# Altium schematic sheet CP2102.SchDoc
size A4
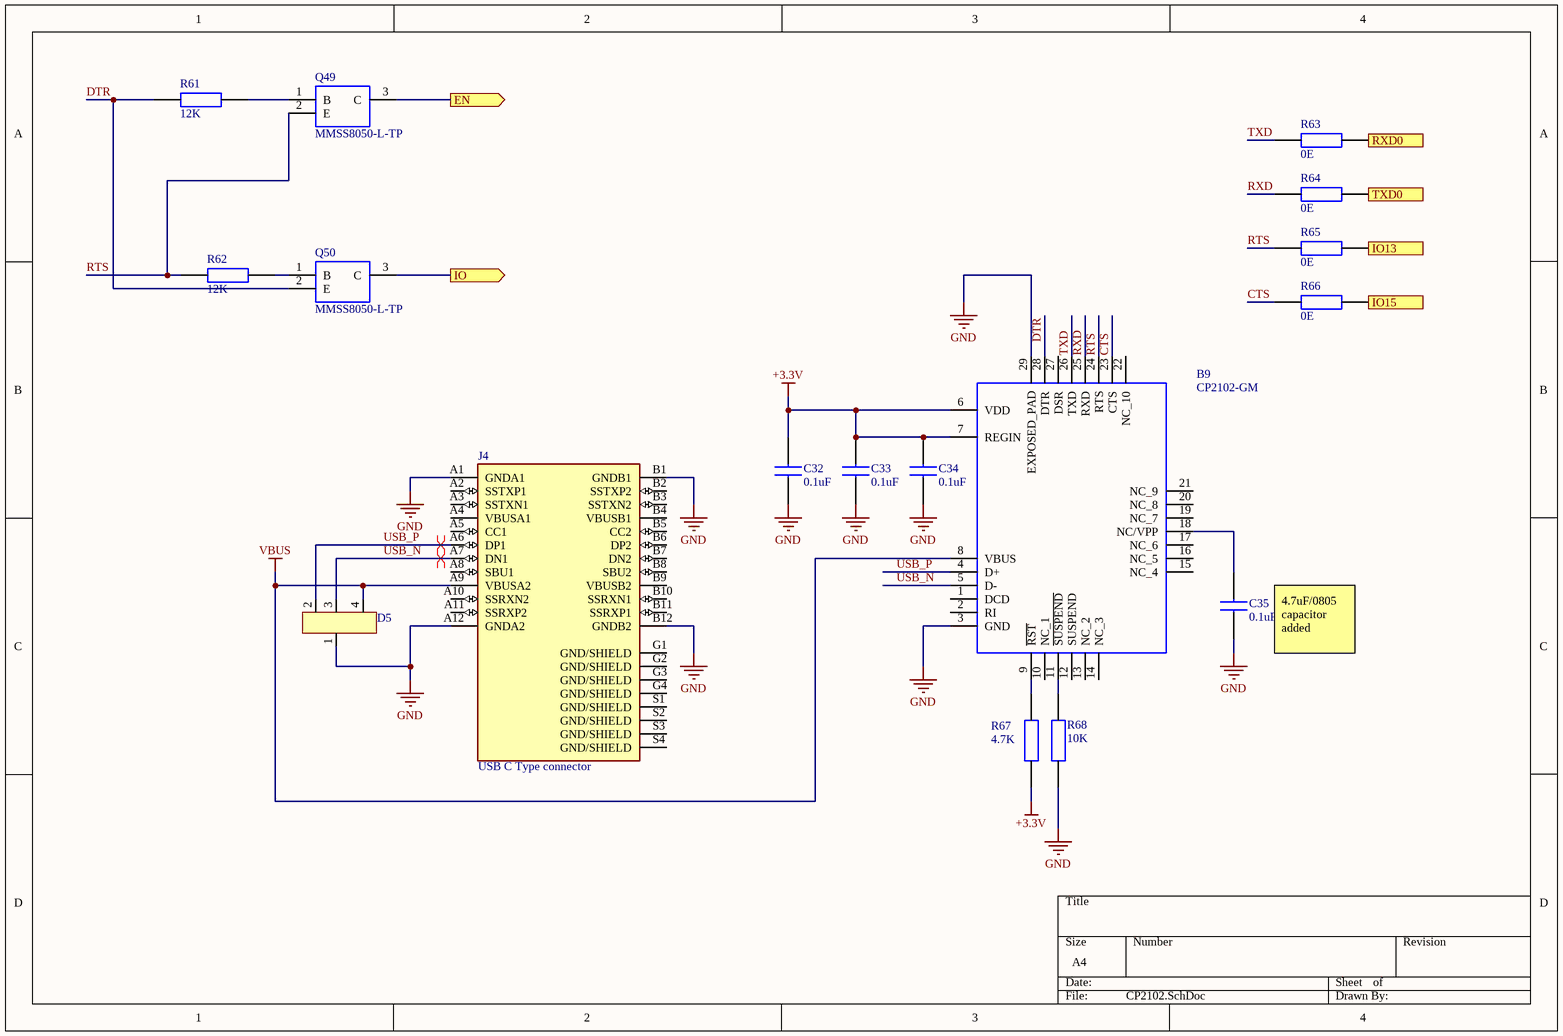
[diagram p0: CP2102.SchDoc]

## Parts
B9  CP2102-GM  [QFN-28]
C32  0.1uF  [CAPC1005X55N]
C33  0.1uF  [CAPC1005X55N]
C34  0.1uF  [CAPC1005X55N]
C35  0.1uF  [CAPC1005X55N]
D5  SP0504BAJTG_ESD Diode  [SOT-143-4]  (value not drawn)
J4  USB C Type connector  [USB C Type connector]
Q49  MMSS8050-L-TP  [SOT96P237X112-3N]
Q50  MMSS8050-L-TP  [SOT96P237X112-3N]
R61  12K  [RESC1005X40N]
R62  12K  [RESC1005X40N]
R63  0E  [RESC1005X40N]
R64  0E  [RESC1005X40N]
R65  0E  [RESC1005X40N]
R66  0E  [RESC1005X40N]
R67  4.7K  [RESC1005X40N]
R68  10K  [RESC1005X40N]

## Ports
EN (out), IO13 (out), IO15 (out), IO (out), RXD0 (out), TXD0 (in)

## Nets
+3.3V: B9.6(VDD) B9.7(REGIN) C32.2 C33.2 C34.2 R67.1
GND: B9.3(GND) B9.29(EXPOSED_PAD) C32.1 C33.1 C34.1 C35.1 D5.1 J4.A1(GNDA1) J4.A12(GNDA2) J4.B1(GNDB1) J4.B12(GNDB2) R68.1
VBUS: B9.8(VBUS) D5.4 J4.A9(VBUSA2)
CTS: B9.23(CTS) R66.1
DTR: B9.28(DTR) Q50.2(E) R61.1
EN: Q49.3(C) ; port EN
IO: Q50.3(C) ; port IO
IO13: R65.2 ; port IO13
IO15: R66.2 ; port IO15
RTS: B9.24(RTS) Q49.2(E) R62.1 R65.1
RXD: B9.25(RXD) R64.1
RXD0: R63.2 ; port RXD0
TXD: B9.26(TXD) R63.1
TXD0: R64.2 ; port TXD0
USB_N: B9.5(D-) D5.3 J4.A7(DN1)
USB_P: B9.4(D+) D5.2 J4.A6(DP1)
NetB9_9: B9.9(~{RST}) R67.2
NetB9_11: B9.11(~{SUSPEND}) R68.2
NetB9_18: B9.18(NC/VPP) C35.2
NetQ49_1: Q49.1(B) R61.2
NetQ50_1: Q50.1(B) R62.2

Not connected (* = marked no-connect by the designer): B9 1(DCD) 2(RI) 10(NC_1) 12(SUSPEND) 13(NC_2) 14(NC_3) 15(NC_4) 16(NC_5) 17(NC_6) 19(NC_7) 20(NC_8) 21(NC_9) 22(NC_10) 27(DSR); J4 A2(SSTXP1) A3(SSTXN1) A4(VBUSA1) A5(CC1) A8(SBU1) A10(SSRXN2) A11(SSRXP2) B2(SSTXP2) B3(SSTXN2) B4(VBUSB1) B5(CC2) B6(DP2) B7(DN2) B8(SBU2) B9(VBUSB2) B10(SSRXN1) B11(SSRXP1) G1(GND/SHIELD) G2(GND/SHIELD) G3(GND/SHIELD) G4(GND/SHIELD) S1(GND/SHIELD) S2(GND/SHIELD) S3(GND/SHIELD) S4(GND/SHIELD)

## Layout directives
differential pair: USB_N, USB_P

## Notes on the sheet
- (near C35) 4.7uF/0805 capacitor added

## Library data of the parts
B9 = CP2102-GM: CP2102-GM, USB Controller 12Mbit/s USB 2.0, 3.3 V, 28-Pin, QFN; Manufacturer_Name: Silicon Labs; Geometry.Height: 1mm; Manufacturer_Part_Number: CP2102-GM; Arrow Part Number: CP2102-GM; Arrow Price/Stock: https://www.arrow.com/en/products/cp2102-gm/silicon-labs; Mouser Part Number: 634-CP2102-GM; Mouser Price/Stock: https://www.mouser.co.uk/ProductDetail/Silicon-Labs/CP2102-GM?qs=yHCtFi5ROqJvCcyR88R4Pg%3D%3D; Datasheet Link: http://docs-emea.rs-online.com/webdocs/065a/0900766b8065a805.pdf
C32-C35 = C0402C104M4RECTU: Multilayer Ceramic Capacitors MLCC - SMD/SMT 16V 0.1uF X7R 0402 20%; Manufacturer: Kemet; Part Number: C0402C104M4RECTU; Mouser Link: *; F: *
D5 = SP0504BAJTG_ESD Diode: Part Number: SP0503BAHTG; Manufacturer: Little Fuse; Footprint Doc: SOT-143-4
J4 = USB C Type connector: Part Number: 632723100011
Q49 Q50 = MMSS8050-L-TP: Bipolar Transistors - BJT 625mW, 25V, 1500mA; Manufacturer_Name: Micro Commercial Components (MCC); Geometry.Height: 1.12mm; Manufacturer_Part_Number: MMSS8050-L-TP; Arrow Part Number: MMSS8050-L-TP; Arrow Price/Stock: https://www.arrow.com/en/products/mmss8050-l-tp/micro-commercial-components; Mouser Part Number: 833-MMSS8050-L-TP; Mouser Price/Stock: https://www.mouser.co.uk/ProductDetail/Micro-Commercial-Components-MCC/MMSS8050-L-TP?qs=FaVZESsvgnebflbaqJWJVQ%3D%3D; Datasheet Link: https://componentsearchengine.com/Datasheets/1/MMSS8050-L-TP.pdf
R61 R62 = RC0402FR-0712KL: RESISTOR, 0402 12K Ohms +/-1% 1/16 W; Manufacturer_Name: YAGEO (PHYCOMP); Geometry.Height: 0.4mm; Manufacturer_Part_Number: RC0402FR-0712KL; Arrow Part Number: RC0402FR-0712KL; Arrow Price/Stock: *; Mouser Part Number: 603-RC0402FR-0712KL; Mouser Price/Stock: https://www.mouser.com/Search/Refine.aspx?Keyword=603-RC0402FR-0712KL; Datasheet Link: http://www.yageo.com/documents/recent/PYu-RC0402_51_RoHS_L_6_r.pdf
R63-R66 = RC0402FR-070RL: Thick Film Resistors - SMD 0.0ohm 1%; Manufacturer_Name: YAGEO (PHYCOMP); Geometry.Height: 0.4mm; Manufacturer_Part_Number: RC0402FR-070RL; Arrow Part Number: RC0402FR-070RL; Arrow Price/Stock: https://www.arrow.com/en/products/rc0402fr-070rl/yageo; Mouser Part Number: 603-RC0402FR-070RL; Mouser Price/Stock: https://www.mouser.co.uk/ProductDetail/Yageo/RC0402FR-070RL?qs=sxZXDnvRBEhfSy4CZGX2ww%3D%3D; Datasheet Link: http://www.yageo.com/documents/recent/PYu-RC0402_51_RoHS_L_6_r.pdf
R67 = RC0402FR-074K7L: YAGEO (PHYCOMP) - RC0402FR-074K7L - RES, THICK FILM, 4K7, 1%, 0.063W, 0402; Geometry.Height: 0.4mm; Manufacturer_Name: YAGEO (PHYCOMP); Manufacturer_Part_Number: RC0402FR-074K7L; Arrow Part Number: RC0402FR-074K7L; Arrow Price/Stock: https://www.arrow.com/en/products/rc0402fr-074k7l/yageo; Mouser Part Number: 603-RC0402FR-074K7L; Mouser Price/Stock: https://www.mouser.co.uk/ProductDetail/Yageo/RC0402FR-074K7L?qs=V1yeUXFNrkn%2FmCXC8N8TTA%3D%3D; Datasheet Link: http://www.yageo.com/documents/recent/PYu-RC0402_51_RoHS_L_6_r.pdf
R68 = RC0402JR-0710KL: YAGEO (PHYCOMP) - RC0402JR-0710KL - RES, THICK FILM, 10K, 5%, 0.0625W, 0402; Geometry.Height: 0.4mm; Manufacturer_Name: YAGEO (PHYCOMP); Manufacturer_Part_Number: RC0402JR-0710KL; Arrow Part Number: RC0402JR-0710KL; Arrow Price/Stock: *; Mouser Part Number: 603-RC0402JR-0710KL; Mouser Price/Stock: https://www.mouser.co.uk/ProductDetail/Yageo/RC0402JR-0710KL?qs=V1yeUXFNrkk4BhFptVo0Rw%3D%3D; Datasheet Link: http://www.yageo.com/documents/recent/PYu-RC0402_51_RoHS_L_6_r.pdf